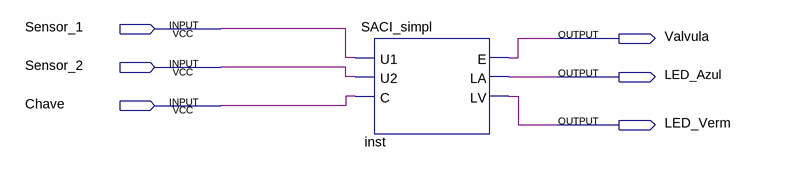
[diagram p0: schematic sheet]
// Quartus schematic esquematico.bdf as structural Verilog: 1 symbols, 6 pins
module esquematico (
  input  Sensor_1,
  input  Sensor_2,
  input  Chave,
  output Valvula,
  output LED_Azul,
  output LED_Verm
);

  SACI_simpl inst (.U1(Sensor_1), .U2(Sensor_2), .C(Chave), .E(Valvula), .LA(LED_Azul), .LV(LED_Verm));
endmodule
